# Altium schematic sheet DriverModule.SchDoc
size A4; SheetNumber: 1; SheetTotal: 2
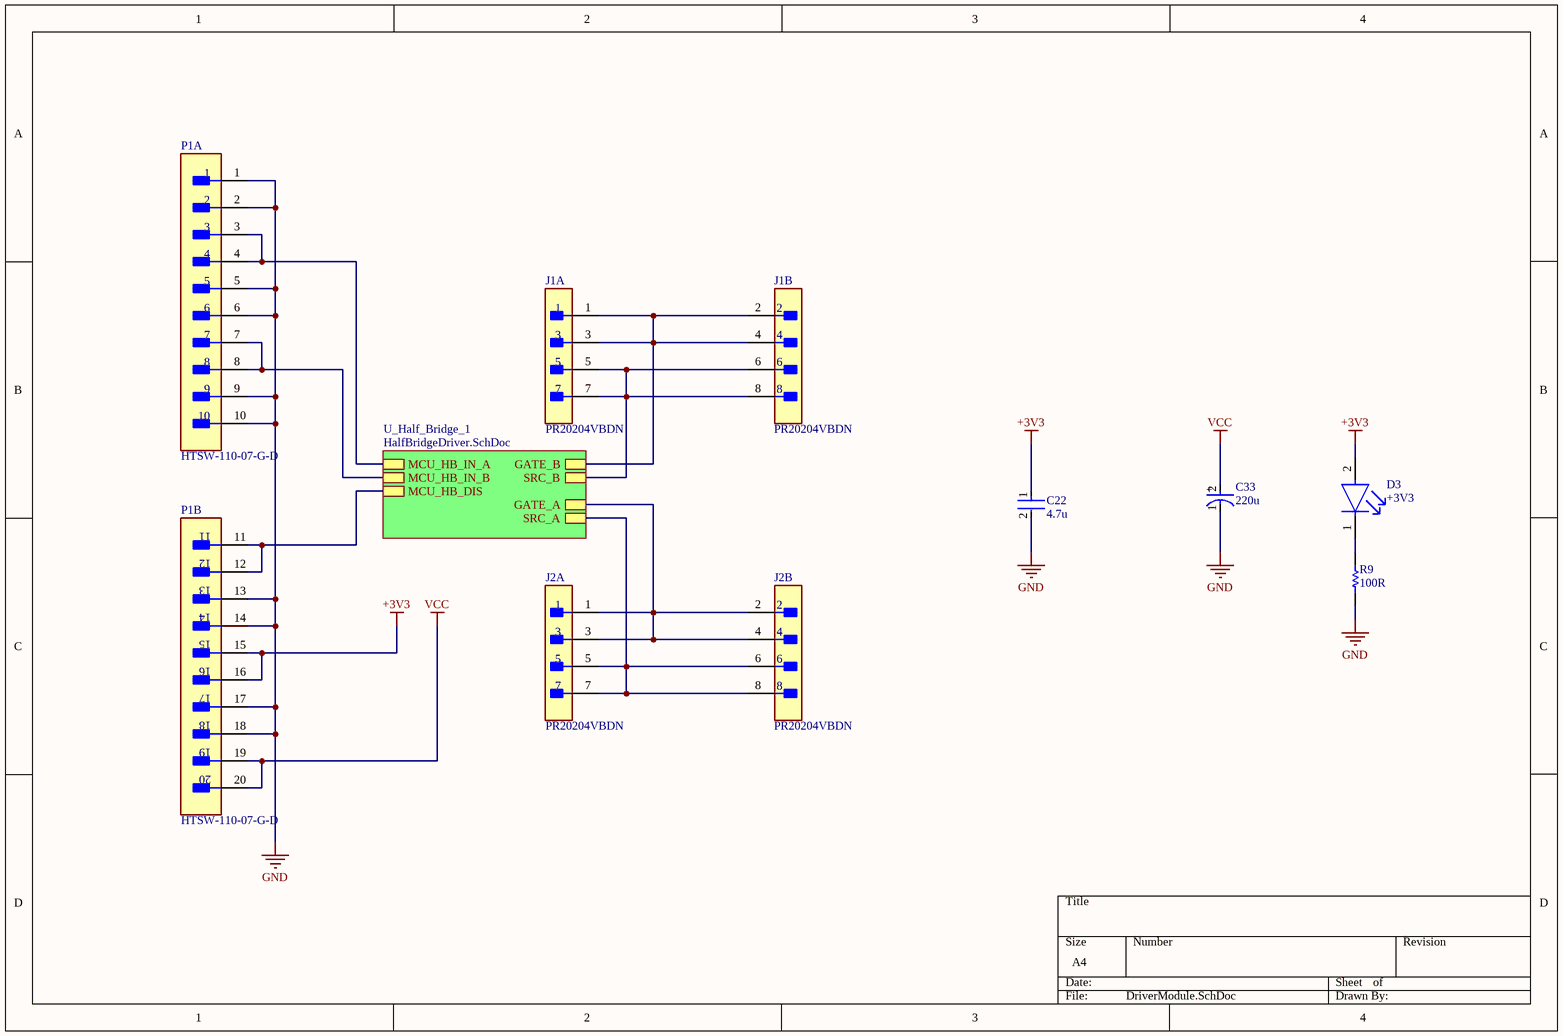
[diagram p0: DriverModule.SchDoc]

## Parts
C22  4.7u  [FP-GRM31C-0_2-e0_3_0_8-IPC_C]
C33  220u  [FP-RAD-TH-D_5_0_5-L_7_1-F-MFG]
D3  +3V3  [FP-LTST-C171KGKT-MFG]
J1  PR20204VBDN  [FP-PR20204VBDN-MFG]  (parts A,B of 2)
J2  PR20204VBDN  [FP-PR20204VBDN-MFG]  (parts A,B of 2)
P1  HTSW-110-07-G-D  [FP-HTSW-110-07-G-D-MFG]  (parts A,B of 2)
R9  100R  [RESC2013X60X35ML10T20]

## Sub-sheets
U_Half_Bridge_1 = HalfBridgeDriver.SchDoc: GATE_B, SRC_B, GATE_A, SRC_A, MCU_HB_IN_B, MCU_HB_IN_A, MCU_HB_DIS

## Nets
+3V3: C22.1 D3.2(A) P1.15 P1.16
GND: C22.2 C33.1(C) P1.1 P1.2 P1.5 P1.6 P1.9 P1.10 P1.13 P1.14 P1.17 P1.18 R9.1
VCC: C33.2(A) P1.19 P1.20
NetD3_1: D3.1(C) R9.2
NetJ1_1: J1.1 J1.2 J1.3 J1.4 ; sheet U_Half_Bridge_1/GATE_B
NetJ1_5: J1.5 J1.6 J1.7 J1.8 ; sheet U_Half_Bridge_1/SRC_B
NetJ2_1: J2.1 J2.2 J2.3 J2.4 ; sheet U_Half_Bridge_1/GATE_A
NetJ2_5: J2.5 J2.6 J2.7 J2.8 ; sheet U_Half_Bridge_1/SRC_A
NetP1_3: P1.3 P1.4 ; sheet U_Half_Bridge_1/MCU_HB_IN_A
NetP1_7: P1.7 P1.8 ; sheet U_Half_Bridge_1/MCU_HB_IN_B
NetP1_11: P1.11 P1.12 ; sheet U_Half_Bridge_1/MCU_HB_DIS

## Notes on the sheet
- (in symbol CMP-05427-001207-1) +

## Library data of the parts
C22 = CMP-06035-057352-1: Chip Multilayer Ceramic Capacitors for General Purpose, 1206, 4.7uF, X7R, 15%, 20%, 50V; Height: 1.6mm; Capacitance: 4.7uF; Radiation Hardening: No; Min Operating Temperature: -55°C; Tolerance: 20%; Packaging: Tape and Reel; Case Code (Imperial): 1206; Mount: Surface Mount; Termination: SMD/SMT; Case/Package: 1206; Depth: 1.6mm; Width: 0.063inch; Max Operating Temperature: 125°C; Thickness: 0.071inch; Voltage Rating (DC): 50V; Package Quantity: 2000; Voltage Rating: 50V; Lead Free: Lead Free; Length: 3.2mm; Case Code (Metric): 3216; Dielectric: X7R
C33 = CMP-05427-001207-1: Aluminum Electrolytic Capacitors (Radial Lead Type) 22uF ±20% 25V; Ripple Current: 55mA; Life (Hours): 1000Hour; Length: 7mm; Series: KA; RoHS Compliant: Yes; Lead Pitch: 2.5mm; Capacitance: 22uF; Height: 7mm; Packaging: Ammo Pack; Package Quantity: 2000; Radiation Hardening: No; Diameter: 5mm; Min Operating Temperature: -40°C; Termination: Radial; Height - Seated (Max): 0.315inch; Max Operating Temperature: 85°C; Mount: Through Hole; Case/Package: Radial; Tolerance: 20%; Voltage Rating (DC): 25V; Voltage Rating: 25V
D3 = CMP-22017-000037-1: LED GREEN CLEAR SMD; Number of LEDs: 1; Viewing Angle: 130°; Lens Style: Rectangular; Dominant Wavelength: 571nm; Test Current: 20mA; Luminous Intensity: 35mcd; Power Rating: 75mW; Forward Voltage: 2.4V; Forward Current: 30mA; Reverse Voltage: 5V; Lens Color: Colorless; Wavelength: 574nm; Height: 0.8mm; Illumination Color: Green; Length: 2mm; Case/Package: 0805; Number of Pins: 2; Number of Elements: 1; Package Quantity: 1; Depth: 1.25mm; Lens Transparency: Clear; Width: 1.25mm; Color: Green; Radiation Hardening: No; Mount: Surface Mount; Packaging: Tape and Reel; Case Code (Metric): 2012; Lead Free: Lead Free; Max Operating Temperature: 85°C; Min Operating Temperature: -55°C; Case Code (Imperial): 0805; Power Dissipation: 75mW
J1 J2 = CMP-77940-000004-1: PIN HEADER, THR, DUAL ROW, .100"
P1 = CMP-02766-001761-1: CONN HEADER VERT 20POS 2.54MM; Row Spacing: 0.1inch; Number of Contacts: 20; Max Voltage Rating (AC): 550V; Gender: Male; Connector Type: Male Pin; Max Current Rating: 7.6A; Housing Material: Polymer; Series: HTSW; Contact Mating Length: 0.23inch; Number of Rows: 2; Reach SVHC Compliant: Yes; Depth: 5.02mm; Color: Natural; Max Operating Temperature: 125°C; Pitch: 0.1inch; Contact Type: Male Pin; Mount: Through Hole; Number of Positions: 20; Contact Plating: Gold; Length: 25.4mm; RoHS Compliant: Yes; Termination: Solder; Packaging: Bulk; Housing Color: Natural; Package Quantity: 1; Min Operating Temperature: -55°C; Contact Material: Bronze; Orientation: Straight
R9 = CMP-2100-03669-1: Chip Resistor, 100 Ohm, +/-1%, 0.125 W, -55 to 155 degC, 0805 (2012 Metric), RoHS, Tape and Reel; Manufacturer: Yageo; Power Rating: 125mW; Resistance: 100Ohm; Voltage Rating: 150V; Tolerance: 1%; Temperature Coefficient: 100ppm/degreesC; Length: 2mm; Package Description: 2-Pin Surface Mounted Device, Body 2 x 1.25 mm; Case Code (Imperial): 0805; Number of Pins: 2; Termination: SMD/SMT; Lead Pitch: 0.4mm; Package Quantity: 1; Height: 0.024inch; Case Code (Metric): 2012; Number of Terminations: 2; Datasheet Version: Rev. 5, 10/2016; Lead Free: LeadFree; Package Reference: 0805; Composition: ThickFilm; REACH SVHC: Unknown; Voltage Rating (DC): 150V; Min Operating Temperature: -55degC; Packaging: TapeandReel; Military Standard: Not; Case/Package: 0805; Datasheet URL: http://www.yageo.com/NewPortal/yageodocoutput?fileName=/pdf/R-Chip/PYu-RC_Group_51_RoHS_L_5.pdf; Max Operating Temperature: 155degC; Manufacturer URL: http://www.yageo.com/; Max Power Dissipation: 125mW; Width: 0.049inch; Depth: 1.25mm; RoHSCompliant: true